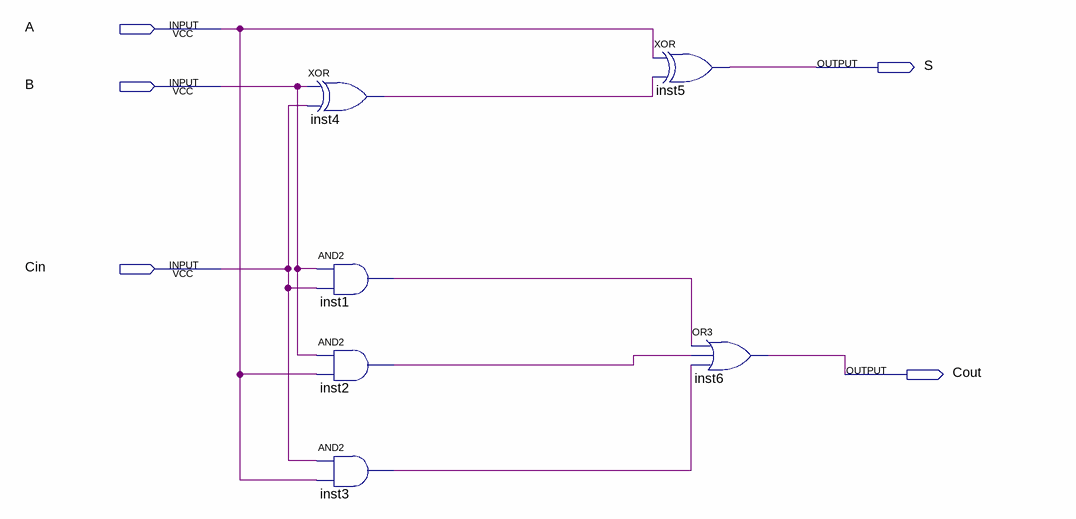
[diagram p0: schematic sheet]
// Quartus schematic FA.bdf as structural Verilog: 6 symbols, 5 pins
module FA (
  input  A,
  input  B,
  input  Cin,
  output S,
  output Cout
);

  wire inst1_out, inst2_out, inst3_out, inst4_out;

  xor inst4 (inst4_out, B, Cin);
  and inst1 (inst1_out, B, Cin);
  and inst2 (inst2_out, B, A);
  and inst3 (inst3_out, Cin, A);
  xor inst5 (S, A, inst4_out);
  or inst6 (Cout, inst1_out, inst2_out, inst3_out);
endmodule
